# Altium schematic sheet Remote.SchDoc
size A3
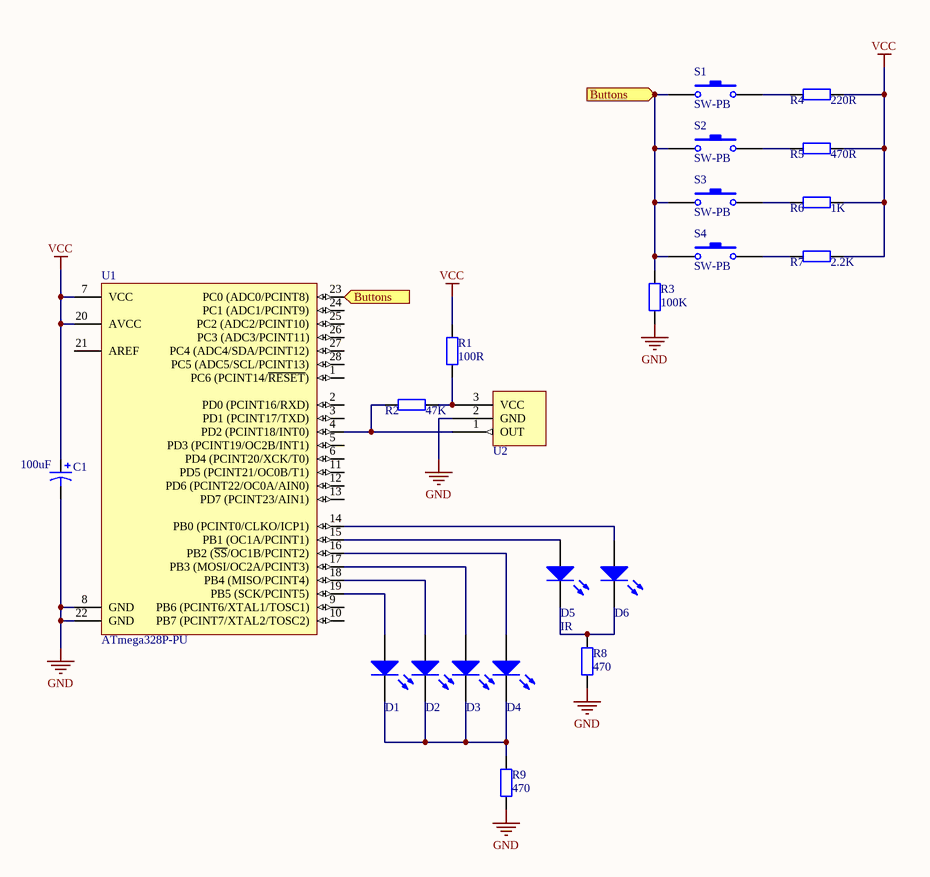
[diagram p0: Remote.SchDoc]

## Parts
C1  value 100uF  [RB7.6-15]  (hidden comment: Cap Pol1)
D1  LED0  [LED-0]  (value not drawn)
D2  LED0  [LED-0]  (value not drawn)
D3  LED0  [LED-0]  (value not drawn)
D4  LED0  [LED-0]  (value not drawn)
D5  IR  [LED-0]
D6  LED0  [LED-0]  (value not drawn)
R1  value 100R  [AXIAL-0.4]  (hidden comment: Res2)
R2  value 47K  [AXIAL-0.4]  (hidden comment: Res2)
R3  value 100K  [AXIAL-0.4]  (hidden comment: Res2)
R4  value 220R  [AXIAL-0.4]  (hidden comment: Res2)
R5  value 470R  [AXIAL-0.4]  (hidden comment: Res2)
R6  value 1K  [AXIAL-0.4]  (hidden comment: Res2)
R7  value 2.2K  [AXIAL-0.4]  (hidden comment: Res2)
R8  value 470  [AXIAL-0.4]  (hidden comment: Res2)
R9  value 470  [AXIAL-0.4]  (hidden comment: Res2)
S1  SW-PB  [SPST-2]
S2  SW-PB  [SPST-2]
S3  SW-PB  [SPST-2]
S4  SW-PB  [SPST-2]
U1  ATmega328P-PU  [28P3]
U2  CHO 1838  (value not drawn)

## Ports
Buttons

## Nets
GND: C1.2 R3.1 R8.1 R9.1 U1.8(GND) U1.22(GND) U2.2(GND)
VCC: C1.1 R1.2 R4.2 R5.2 R6.2 R7.2 U1.7(VCC) U1.20(AVCC)
Buttons: R3.2 S1.1 S2.1 S3.1 S4.1 U1.23(PC0_(ADC0/PCINT8)) ; port Buttons
NetD1_1: D1.1(A) U1.19(PB5_(SCK/PCINT5))
NetD1_2: D1.2(K) D2.2(K) D3.2(K) D4.2(K) R9.2
NetD2_1: D2.1(A) U1.18(PB4_(MISO/PCINT4))
NetD3_1: D3.1(A) U1.17(PB3_(MOSI/OC2A/PCINT3))
NetD4_1: D4.1(A) U1.16(PB2_(~{SS}/OC1B/PCINT2))
NetD5_1: D5.1(A) U1.15(PB1_(OC1A/PCINT1))
NetD5_2: D5.2(K) D6.2(K) R8.2
NetD6_1: D6.1(A) U1.14(PB0_(PCINT0/CLKO/ICP1))
NetR1_1: R1.1 R2.2 U2.3(VCC)
NetR2_1: R2.1 U1.4(PD2_(PCINT18/INT0)) U2.1(OUT)
NetR4_1: R4.1 S1.2
NetR5_1: R5.1 S2.2
NetR6_1: R6.1 S3.2
NetR7_1: R7.1 S4.2

Not connected (* = marked no-connect by the designer): U1 1(PC6_(PCINT14/~{RESET})) 2(PD0_(PCINT16/RXD)) 3(PD1_(PCINT17/TXD)) 5(PD3_(PCINT19/OC2B/INT1)) 6(PD4_(PCINT20/XCK/T0)) 9(PB6_(PCINT6/XTAL1/TOSC1)) 10(PB7_(PCINT7/XTAL2/TOSC2)) 11(PD5_(PCINT21/OC0B/T1)) 12(PD6_(PCINT22/OC0A/AIN0)) 13(PD7_(PCINT23/AIN1)) 21(AREF) 24(PC1_(ADC1/PCINT9)) 25(PC2_(ADC2/PCINT10)) 26(PC3_(ADC3/PCINT11)) 27(PC4_(ADC4/SDA/PCINT12)) 28(PC5_(ADC5/SCL/PCINT13))

## Library data of the parts
C1 = Cap Pol1: Polarized Capacitor (Radial); Published: 8-Jun-2000; LatestRevisionDate: 17-Jul-2002; LatestRevisionNote: Re-released for DXP Platform.; PackageReference: RB7.6-15; Publisher: Altium Limited; PackageDescription: Polarized Capacitor (Radial); 2 Leads
D1-D6 = LED0: Typical INFRARED GaAs LED; Published: 8-Jun-2000; LatestRevisionDate: 08-Jul-2005; LatestRevisionNote: Mech Layer 1 removed.; PackageReference: LED-0; Publisher: Altium Limited; PackageDescription: LED; 2 Leads
R1-R9 = Res2: Resistor; Published: 8-Jun-2000; LatestRevisionDate: 17-Jul-2002; LatestRevisionNote: Re-released for DXP Platform.; PackageReference: AXIAL-0.4; Publisher: Altium Limited; PackageDescription: Axial Device, Thru-Hole; 2 Leads; 0.4 in Pin Spacing
S1-S4 = SW-PB: Switch; Published: 24-Mar-1999; LatestRevisionDate: 17-Jul-2002; LatestRevisionNote: Re-released for DXP Platform.; PackageReference: SPST-2; Publisher: Altium Limited; PackageDescription: Switch; 2 Leads
U1 = ATmega328P-PU: 8-bit AVR Microcontroller, 32KB Flash, 1KB EEPROM, 2KB SRAM, 28-pin PDIP, Industrial Grade (-40°C to 85°C); DatasheetVersion: revD, May-2011; PackageVersion: revB, Sep-2001; PackageReference: 28P3; PackageDescription: 28-lead (0.300"/7.62mm Wide) Plastic Dual Inline Package (PDIP); ComponentLink1Description: Manufacturer URL; ComponentLink1URL: http://www.atmel.com/; ComponentLink2Description: ATmega48A/48PA/88A/88PA/168A/168PA/328/328P Datasheet; ComponentLink2URL: http://www.atmel.com/dyn/resources/prod_documents/8271.pdf; ComponentLink3Description: ATmega48A/48PA/88A/88PA/168A/168PA/328/328P Summary; ComponentLink3URL: http://www.atmel.com/dyn/resources/prod_documents/8271S.pdf
U2 = CHO 1838: IR Receiver